# Altium schematic sheet STM32G473CET6_PINOUT.SchDoc
size C; SheetNumber: 2; SheetTotal: 5
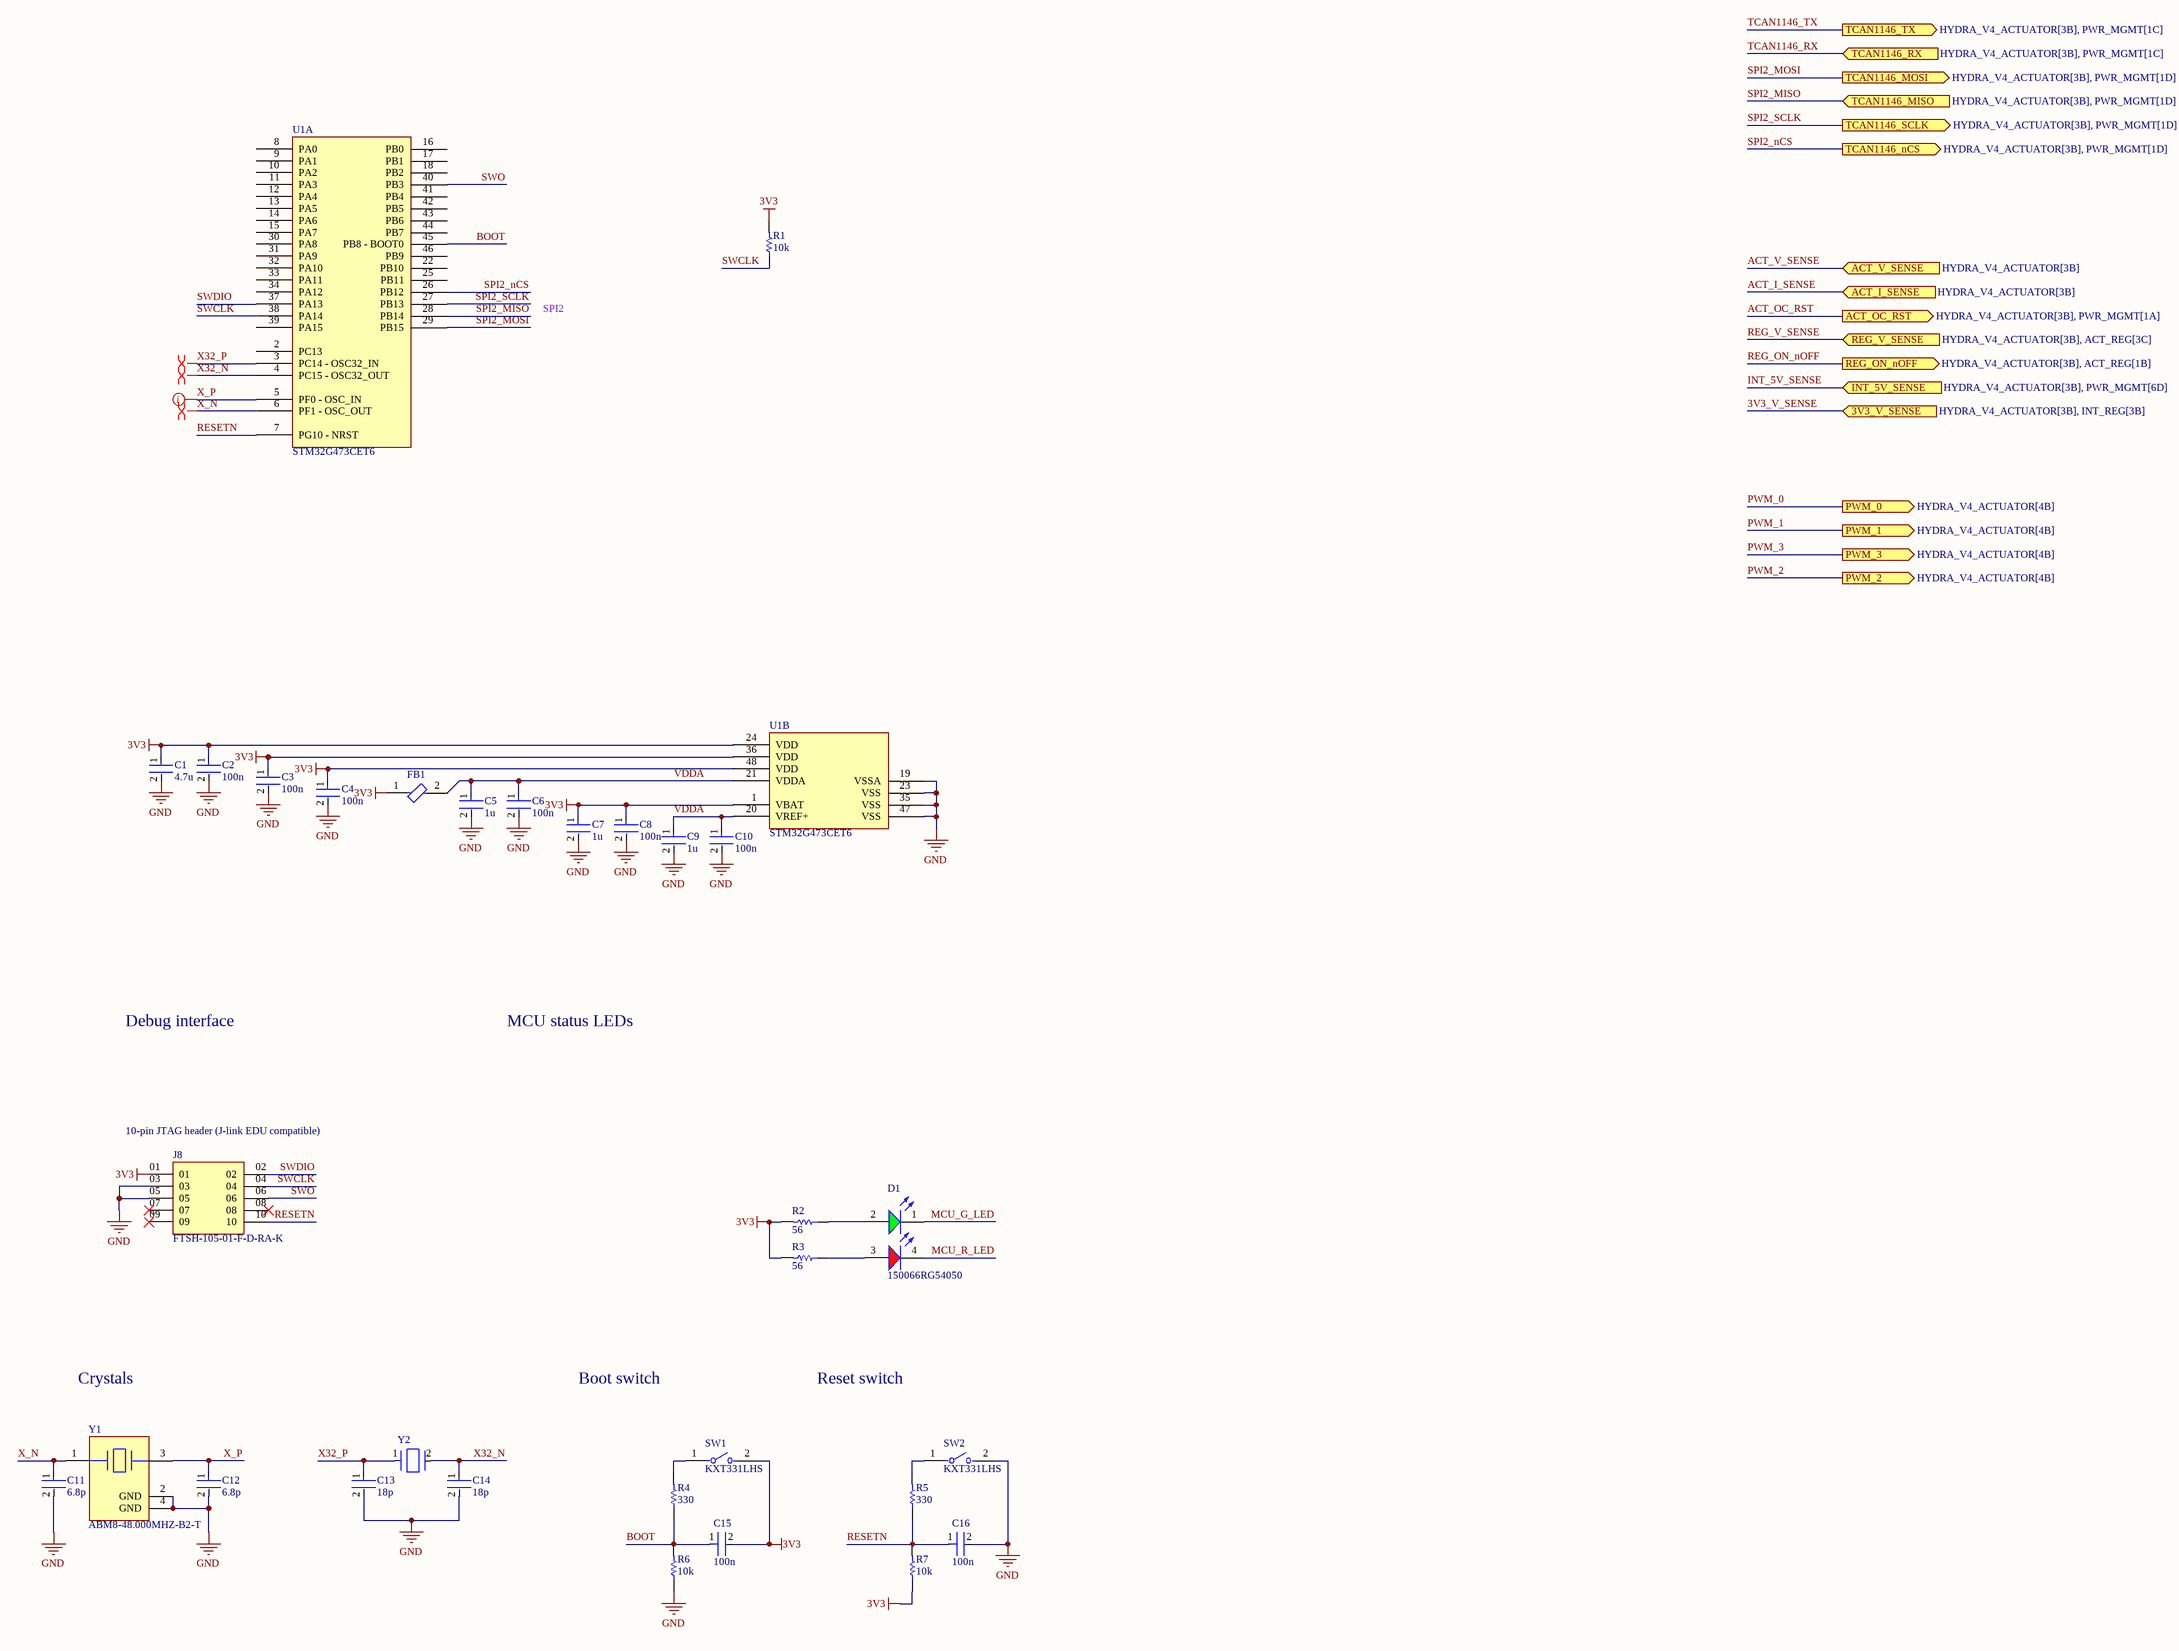
[diagram p0: STM32G473CET6_PINOUT.SchDoc]

## Parts
C1  4.7u  [FP-0402-L_1_0_0_05-W_0_5-IPC_A]
C2  100n  [FP-0402-L_1_0_0_05-W_0_5-IPC_A]
C3  100n  [FP-0402-L_1_0_0_05-W_0_5-IPC_A]
C4  100n  [FP-0402-L_1_0_0_05-W_0_5-IPC_A]
C5  1u  [FP-0402-L_1_0_0_05-W_0_5-IPC_A]
C6  100n  [FP-0402-L_1_0_0_05-W_0_5-IPC_A]
C7  1u  [FP-0402-L_1_0_0_05-W_0_5-IPC_A]
C8  100n  [FP-0402-L_1_0_0_05-W_0_5-IPC_A]
C9  1u  [FP-0402-L_1_0_0_05-W_0_5-IPC_A]
C10  100n  [FP-0402-L_1_0_0_05-W_0_5-IPC_A]
C11  6.8p  [FP-0402-L_1_0_0_05-W_0_5-IPC_A]
C12  6.8p  [FP-0402-L_1_0_0_05-W_0_5-IPC_A]
C13  18p  [FP-0402-L_1_0_0_05-W_0_5-IPC_A]
C14  18p  [FP-0402-L_1_0_0_05-W_0_5-IPC_A]
C15  100n  [FP-0402-L_1_0_0_05-W_0_5-IPC_A]
C16  100n  [FP-0402-L_1_0_0_05-W_0_5-IPC_A]
D1  150066RG54050  [WL-SBCD_0606]
FB1  BLM15PX601SN1D  [FP-BLM15-0_05-MFG]  (value not drawn)
J8  FTSH-105-01-F-D-RA-K  [FTSH-105-01-F-D-RA-K-Footprint-1]
R1  10k  [R0603B]
R2  56  [R0603B]
R3  56  [R0603B]
R4  330  [R0603B]
R5  330  [R0603B]
R6  10k  [R0603B]
R7  10k  [R0603B]
SW1  KXT331LHS  [FP-KXT331LHS-MFG]
SW2  KXT331LHS  [FP-KXT331LHS-MFG]
U1  STM32G473CET6  [TSQFP50P900X900X160-48N]  (parts A,B of 2)
Y1  ABM8-48.000MHZ-B2-T  [FP-ABM8-MFG]
Y2  ECS-.327-12.5-1210-TR  [FP-ECX-1210-MFG]  (value not drawn)

## Ports
3V3_V_SENSE (in, see HYDRA_V4_ACTUATOR[3B], INT_REG[3B]), ACT_I_SENSE (in, see HYDRA_V4_ACTUATOR[3B]), ACT_OC_RST (out, see HYDRA_V4_ACTUATOR[3B], PWR_MGMT[1A]), ACT_V_SENSE (in, see HYDRA_V4_ACTUATOR[3B]), INT_5V_SENSE (in, see HYDRA_V4_ACTUATOR[3B], PWR_MGMT[6D]), PWM_0 (out, see HYDRA_V4_ACTUATOR[4B]), PWM_1 (out, see HYDRA_V4_ACTUATOR[4B]), PWM_2 (out, see HYDRA_V4_ACTUATOR[4B]), PWM_3 (out, see HYDRA_V4_ACTUATOR[4B]), REG_ON_nOFF (out, see HYDRA_V4_ACTUATOR[3B], ACT_REG[1B]), REG_V_SENSE (in, see HYDRA_V4_ACTUATOR[3B], ACT_REG[3C]), TCAN1146_MISO (in, see HYDRA_V4_ACTUATOR[3B], PWR_MGMT[1D]), TCAN1146_MOSI (out, see HYDRA_V4_ACTUATOR[3B], PWR_MGMT[1D]), TCAN1146_nCS (out, see HYDRA_V4_ACTUATOR[3B], PWR_MGMT[1D]), TCAN1146_RX (in, see HYDRA_V4_ACTUATOR[3B], PWR_MGMT[1C]), TCAN1146_SCLK (out, see HYDRA_V4_ACTUATOR[3B], PWR_MGMT[1D]), TCAN1146_TX (out, see HYDRA_V4_ACTUATOR[3B], PWR_MGMT[1C])

## Nets
3V3: C1.1 C2.1 C3.1 C4.1 C7.1 C8.1 C15.2 FB1.1 J8.01 R1.2 R2.2 R3.2 R7.1 SW1.2 U1.1(VBAT) U1.24(VDD) U1.36(VDD) U1.48(VDD)
GND: C1.2 C2.2 C3.2 C4.2 C5.2 C6.2 C7.2 C8.2 C9.2 C10.2 C11.2 C12.2 C13.2 C14.2 C16.2 J8.03 J8.05 R6.1 SW2.2 U1.19(VSSA) U1.23(VSS) U1.35(VSS) U1.47(VSS) Y1.2(GND) Y1.4(GND)
3V3_V_SENSE: port 3V3_V_SENSE
ACT_I_SENSE: port ACT_I_SENSE
ACT_OC_RST: port ACT_OC_RST
ACT_V_SENSE: port ACT_V_SENSE
BOOT: C15.1 R4.1 R6.2 U1.45(PB8_-_BOOT0)
INT_5V_SENSE: port INT_5V_SENSE
MCU_G_LED: D1.1(K)
MCU_R_LED: D1.4(K)
PWM_0: port PWM_0
PWM_1: port PWM_1
PWM_2: port PWM_2
PWM_3: port PWM_3
REG_ON_nOFF: port REG_ON_nOFF
REG_V_SENSE: port REG_V_SENSE
RESETN: C16.1 J8.10 R5.1 R7.2 U1.7(PG10_-_NRST)
SPI2_MISO: U1.28(PB14) ; port TCAN1146_MISO
SPI2_MOSI: U1.29(PB15) ; port TCAN1146_MOSI
SPI2_nCS: U1.26(PB12) ; port TCAN1146_nCS
SPI2_SCLK: U1.27(PB13) ; port TCAN1146_SCLK
SWCLK: J8.04 R1.1 U1.38(PA14)
SWDIO: J8.02 U1.37(PA13)
SWO: J8.06 U1.40(PB3)
TCAN1146_RX: port TCAN1146_RX
TCAN1146_TX: port TCAN1146_TX
VDDA: C5.1 C6.1 C9.1 C10.1 FB1.2 U1.20(VREF+) U1.21(VDDA)
X32_N: C14.1 U1.4(PC15_-_OSC32_OUT) Y2.2(Out/In)
X32_P: C13.1 U1.3(PC14_-_OSC32_IN) Y2.1(In/Out)
X_N: C11.1 U1.6(PF1_-_OSC_OUT) Y1.1
X_P: C12.1 U1.5(PF0_-_OSC_IN) Y1.3
NetD1_2: D1.2(A) R2.1
NetD1_3: D1.3(A) R3.1
NetR4_2: R4.2 SW1.1
NetR5_2: R5.2 SW2.1

Not connected (* = marked no-connect by the designer): J8 07* 08* 09*; U1 2(PC13) 8(PA0) 9(PA1) 10(PA2) 11(PA3) 12(PA4) 13(PA5) 14(PA6) 15(PA7) 16(PB0) 17(PB1) 18(PB2) 22(PB10) 25(PB11) 30(PA8) 31(PA9) 32(PA10) 33(PA11) 34(PA12) 39(PA15) 41(PB4) 42(PB5) 43(PB6) 44(PB7) 46(PB9)

## Layout directives
differential pair: X32_N, X32_P, X_N, X_P

## Notes on the sheet
- SPI2
- Debug interface
- MCU status LEDs
- (near J8) 10-pin JTAG header (J-link EDU compatible)
- Crystals
- Boot switch
- Reset switch

## Library data of the parts
C1-C16 = CMP-001-00058-1: LARGE PADS, 0402 CAP, CHANGE COMMENT TO MATCH REAL P/N; Capacitor Type: Ceramic; Min Operating Temperature: -55°C; Mounting Technology: Surface Mount; Pins: 2; Case/Package: 0402; RoHS Compliant: Yes; Max Operating Temperature: 85°C
D1 = CMP-004-00040-2: Led, Red/Grn, 180Mcd/230Mcd, 624Nm/525Nm Rohs Compliant: Yes; Source: rgled.SchLib; Component Type: Standard; Design Item ID: CMP-004-00034-2; Pins: 4
FB1 = CMP-0686-00252-4: Chip Ferrite Bead, 0402, 600Ω @ 100MHz, 0.23Ω, 25%, 900mA; Number of Circuits: 1; Impedance: 600R; DC Resistance (DCR): 230mR; Material: Steel; Length: 1mm; Package Quantity: 10000; Height: 0.5mm; Width: 0.5mm; Max DC Current: 900mA; Number of Lines: 1; Termination: SMD/SMT; Packaging: Tape and Reel; Lead Free: Lead Free; Min Operating Temperature: -55°C; Max Operating Temperature: 125°C; Max Current Rating: 900mA; Case Code (Imperial): 0402; Number of Pins: 2; Current Rating: 900mA; Test Frequency: 100MHz; Case/Package: 0402; Tolerance: 25%; Case Code (Metric): 1005
J8 = CMP-002-00041-5: Board Connector, 10 Contact(s), 2 Row(s), Male, Right Angle, 0.05 inch Pitch, Surface Mount Terminal, Locking, Black Insulator; Connector Type: BOARD CONNECTOR; Mounting Technology: Board; RoHS Compliant: Yes
R1-R7 = CMP-009-00002-14: Resistor
SW1 SW2 = CMP-10040-000029-1: SWITCH TACTILE SPST-NO 0.02A 15V; Operating Force: 240gf; Switch Travel: 0.13mm; Illumination Type: Non-Illuminated; Throw Configuration: SPST; Number of Ports: 1; Current Rating: 5A; Mechanical Life: 500000Cycles; Switch Function: Off-Mom; Connector Type: USB; Actuator Type: Standard; Gender: Receptacle; Number of Contacts: 24; Contact Plating: Gold; Insulation Color: Black; Min Operating Temperature: -40°C; Packaging: Tape and Reel; Flammability Rating: UL94 V-0; Max Operating Temperature: 85°C; Termination: Solder; Mount: Surface Mount
U1 = CMP-020-00018-2: RISC Microcontroller, 32-Bit, 170MHz; RoHS Compliant: Yes
Y1 = CMP-27762-011708-1: Crystal 48MHz ±20ppm 18pF SMD-4 3.2mm x 2.5mm; Series Resistance: 35R; Frequency Stability: 50ppm; Package Quantity: 1000; Packaging: Tape and Reel; Mount: Surface Mount; Length: 3.2mm; Load Capacitance: 18pF; Max Operating Temperature: 70°C; Operating Frequency: 48 MHz; RoHS Compliant: Yes; Series: ABM8; Frequency Tolerance: 20ppm; Lead Free: Lead Free; Min Operating Temperature: -20°C; Case/Package: CSMD; Number of Pins: 4; Height: 0.031inch; ESR (Equivalent Series Resistance): 35R; Frequency: 48MHz; Radiation Hardening: No; Width: 0.098inch; Tolerance: 20ppm; Termination: SMD/SMT; Depth: 2.5mm; Resistor Type: Ceramic; REACH SVHC: No SVHC
Y2 = CMP-40224-000006-1: CRYSTAL 32.7680KHZ 12.5PF SMD; Manufacturer: ECS International; Frequency: 32.768kHz; Esr: 90kΩ; Tolerance: 20ppm; Device Class L1: Passive Components; Load Capacitance: 12.5pF; Temperature: -40°C to +85°C; ComponentLink2URL: https://ecsxtal.com/store/pdf/ECX-1210.pdf; Series: ECX-1210; Octopart: https://octopart.com/ecs-.327-12.5-1210-tr-ecs+international-81221340; ComponentLink2Description: Datasheet; Temperature Range Low: -40°C; Digikey Description: CRYSTAL 32.7680KHZ 12.5PF SMD; Lead Free: Yes; RoHS: TRUE; Device Class L3: Crystals; Automotive: No; Category: Crys; Height: 0.5mm; Manufacturer Part Number: ECS-.327-12.5-1210-TR; Temperature Range High: +85°C; Device Class L2: Crystals / Oscillators; Package: ECX-1210